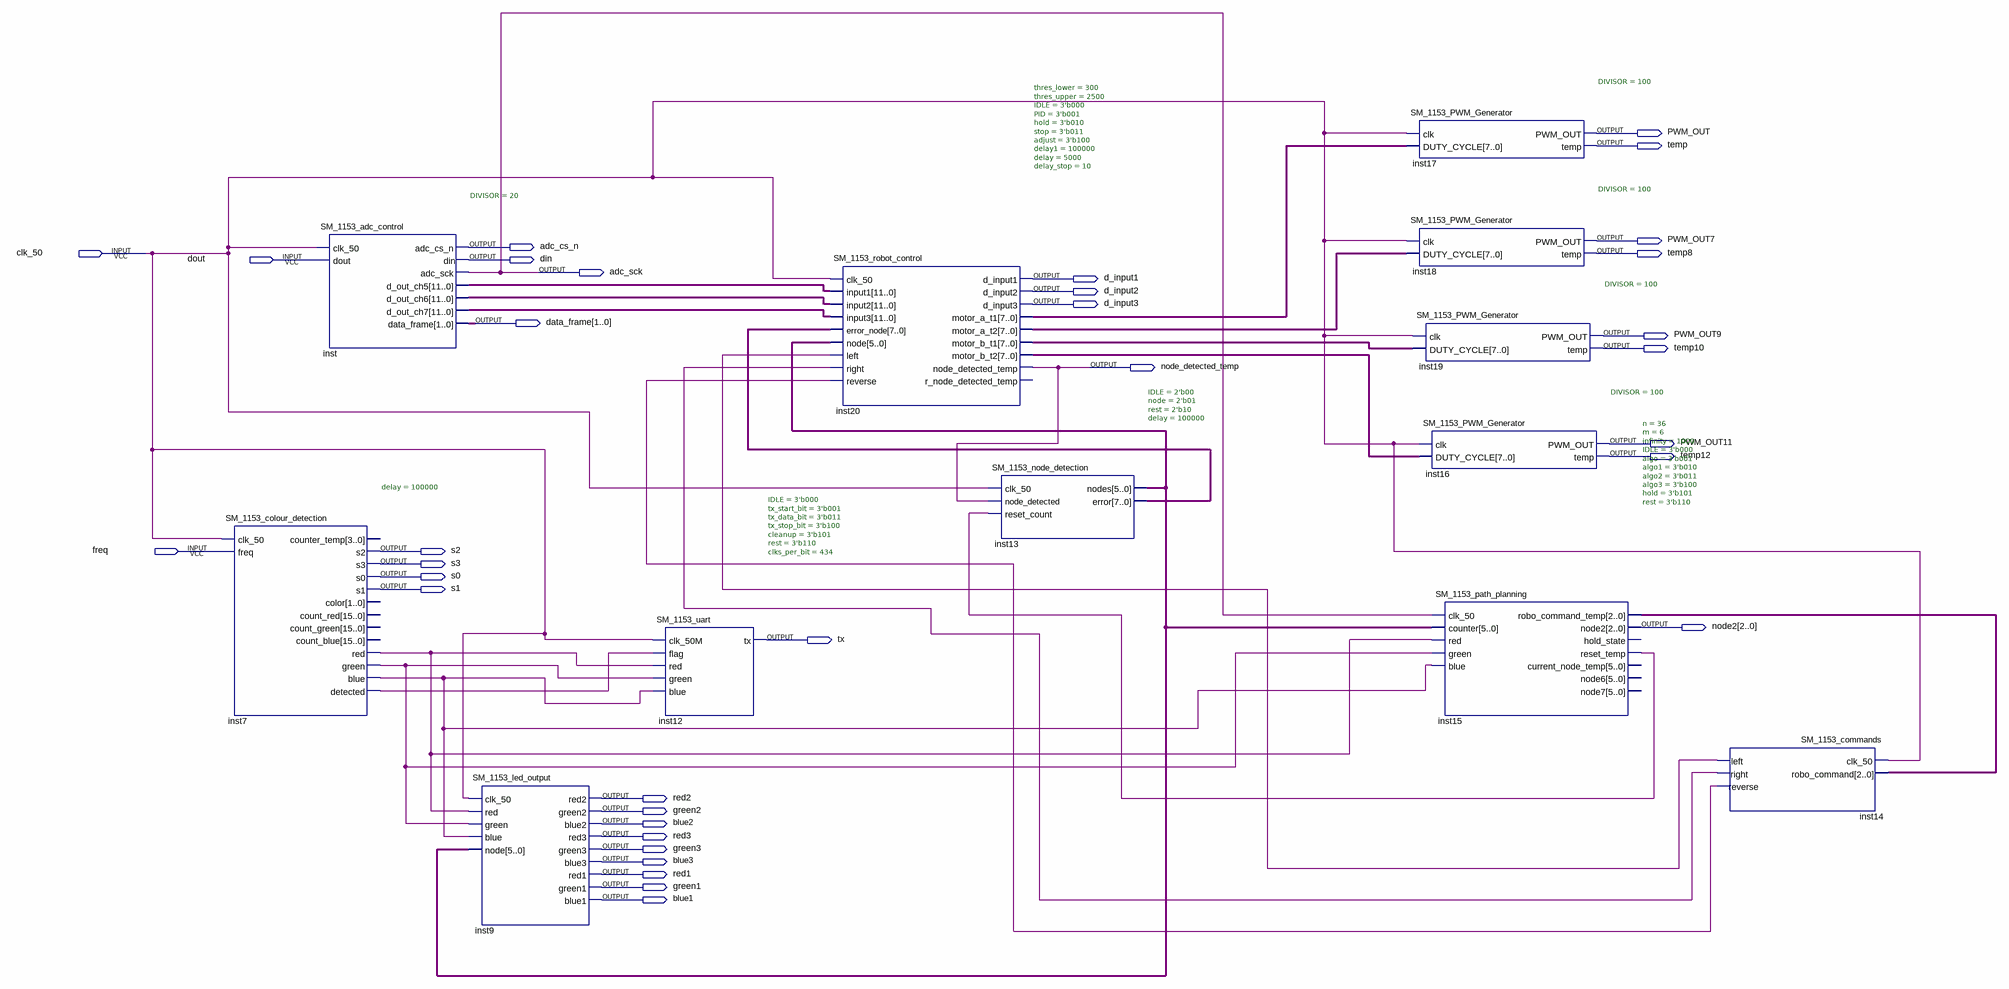
[diagram p0: schematic sheet]
// Quartus schematic SM_1153_task_5.bdf as structural Verilog: 12 symbols, 34 pins
module SM_1153_task_5 (
  input  clk_50,
  input  dout,
  input  freq,
  output PWM_OUT,
  output temp,
  output PWM_OUT7,
  output adc_cs_n,
  output temp8,
  output din,
  output adc_sck,
  output d_input1,
  output d_input2,
  output d_input3,
  output [1:0] data_frame,
  output PWM_OUT9,
  output temp10,
  output node_detected_temp,
  output PWM_OUT11,
  output temp12,
  output s2,
  output s3,
  output s0,
  output s1,
  output [2:0] node2,
  output tx,
  output red2,
  output green2,
  output blue2,
  output red3,
  output green3,
  output blue3,
  output red1,
  output green1,
  output blue1
);

  wire inst7_blue, inst7_detected, inst7_green, inst7_red, inst14_left, inst14_reverse, inst14_right,
       inst15_reset_temp;
  wire [2:0] inst15_robo_command_temp;
  wire [5:0] inst13_nodes;
  wire [7:0] inst13_error, inst20_motor_a_t1, inst20_motor_a_t2, inst20_motor_b_t1, inst20_motor_b_t2;
  wire [11:0] inst_d_out_ch5, inst_d_out_ch6, inst_d_out_ch7;

  SM_1153_colour_detection #(.delay(100000)) inst7 (
    .clk_50(clk_50), .freq(freq), .s2(s2), .s3(s3), .s0(s0), .s1(s1), .red(inst7_red), .green(inst7_green),
    .blue(inst7_blue), .detected(inst7_detected));  // open: counter_temp, color, count_red, count_green, count_blue
  SM_1153_adc_control #(.DIVISOR(20)) inst (
    .clk_50(clk_50), .dout(dout), .adc_cs_n(adc_cs_n), .din(din), .adc_sck(adc_sck),
    .d_out_ch5(inst_d_out_ch5), .d_out_ch6(inst_d_out_ch6), .d_out_ch7(inst_d_out_ch7),
    .data_frame(data_frame));
  SM_1153_led_output inst9 (
    .clk_50(clk_50), .red(inst7_red), .green(inst7_green), .blue(inst7_blue), .node(inst13_nodes),
    .red2(red2), .green2(green2), .blue2(blue2), .red3(red3), .green3(green3), .blue3(blue3), .red1(red1),
    .green1(green1), .blue1(blue1));
  SM_1153_uart #(.IDLE(3'b000), .tx_start_bit(3'b001), .tx_data_bit(3'b011), .tx_stop_bit(3'b100), .cleanup(3'b101), .rest(3'b110), .clks_per_bit(434)) inst12 (
    .clk_50M(clk_50), .flag(inst7_detected), .red(inst7_red), .green(inst7_green), .blue(inst7_blue), .tx(tx));
  SM_1153_robot_control #(.thres_lower(300), .thres_upper(2500), .IDLE(3'b000), .PID(3'b001), .hold(3'b010), .stop(3'b011), .adjust(3'b100), .delay1(100000), .delay(5000), .delay_stop(10)) inst20 (
    .clk_50(clk_50), .input1(inst_d_out_ch5), .input2(inst_d_out_ch6), .input3(inst_d_out_ch7),
    .error_node(inst13_error), .node(inst13_nodes), .left(inst14_left), .right(inst14_right),
    .reverse(inst14_reverse), .d_input1(d_input1), .d_input2(d_input2), .d_input3(d_input3),
    .motor_a_t1(inst20_motor_a_t1), .motor_a_t2(inst20_motor_a_t2), .motor_b_t1(inst20_motor_b_t1),
    .motor_b_t2(inst20_motor_b_t2), .node_detected_temp(node_detected_temp));  // open: r_node_detected_temp
  SM_1153_node_detection #(.IDLE(2'b00), .node(2'b01), .rest(2'b10), .delay(100000)) inst13 (
    .clk_50(clk_50), .node_detected(node_detected_temp), .reset_count(inst15_reset_temp),
    .nodes(inst13_nodes), .error(inst13_error));
  SM_1153_PWM_Generator #(.DIVISOR(100)) inst17 (
    .clk(clk_50), .DUTY_CYCLE(inst20_motor_a_t1), .PWM_OUT(PWM_OUT), .temp(temp));
  SM_1153_PWM_Generator #(.DIVISOR(100)) inst18 (
    .clk(clk_50), .DUTY_CYCLE(inst20_motor_a_t2), .PWM_OUT(PWM_OUT7), .temp(temp8));
  SM_1153_PWM_Generator #(.DIVISOR(100)) inst19 (
    .clk(clk_50), .DUTY_CYCLE(inst20_motor_b_t1), .PWM_OUT(PWM_OUT9), .temp(temp10));
  SM_1153_PWM_Generator #(.DIVISOR(100)) inst16 (
    .clk(clk_50), .DUTY_CYCLE(inst20_motor_b_t2), .PWM_OUT(PWM_OUT11), .temp(temp12));
  SM_1153_path_planning #(.n(36), .m(6), .infinity(1000), .IDLE(3'b000), .algo(3'b001), .algo1(3'b010), .algo2(3'b011), .algo3(3'b100), .hold(3'b101), .rest(3'b110)) inst15 (
    .clk_50(adc_sck), .counter(inst13_nodes), .red(inst7_red), .green(inst7_green), .blue(inst7_blue),
    .robo_command_temp(inst15_robo_command_temp), .node2(node2), .reset_temp(inst15_reset_temp));  // open: hold_state, current_node_temp, node6, node7
  SM_1153_commands inst14 (
    .clk_50(clk_50), .robo_command(inst15_robo_command_temp), .left(inst14_left), .right(inst14_right),
    .reverse(inst14_reverse));
endmodule
